# Altium schematic sheet LV_PCB.SchDoc
size A; SheetNumber: 1; SheetTotal: 1
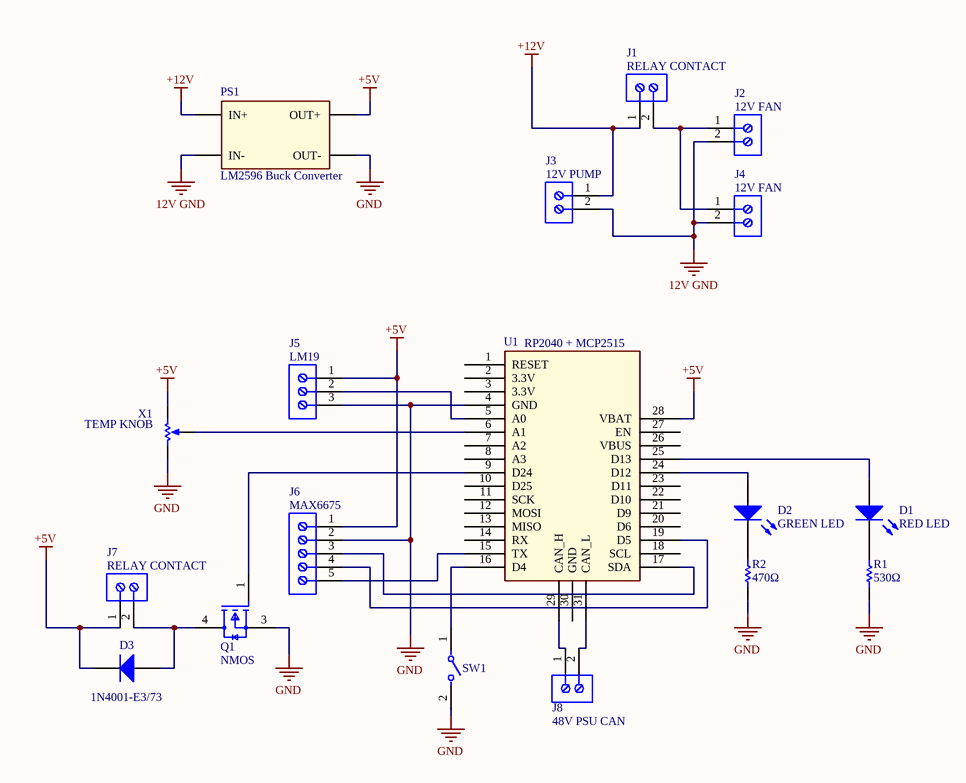
[diagram p0: LV_PCB.SchDoc]

## Parts
D1  RED LED
D2  GREEN LED
D3  1N4001-E3/73
J1  RELAY CONTACT  [2 Pin Screw Terminal 2.54mm]
J2  12V FAN  [2 Pin Screw Terminal 2.54mm]
J3  12V PUMP  [2 Pin Screw Terminal 2.54mm]
J4  12V FAN  [2 Pin Screw Terminal 2.54mm]
J5  LM19  [691254410003]
J6  MAX6675  [691243300005]
J7  RELAY CONTACT  [2 Pin Screw Terminal 2.54mm]
J8  48V PSU CAN  [691254410002]
PS1  LM2596 Buck Converter
Q1  NMOS  [FP-369AS-MFG]
R1  value 530Ω  (hidden comment: Resistor)
R2  value 470Ω  (hidden comment: Resistor)
SW1  A8L-11-12N1  [FP-A8L-11-12N1-MFG]  (value not drawn)
U1  RP2040 + MCP2515
X1  TEMP KNOB

## Nets
12V GND: J2.2 J3.2 J4.2 PS1.N(IN-)
+5V: D3.2(K) J5.1 J6.1 J7.1 PS1.?1(OUT+) U1.28(VBAT) X1.1(TOP)
+12V: J1.1 J3.1 PS1.L(IN+)
GND: J5.3 J6.2 PS1.V-(OUT-) Q1.3(S) R1.1 R2.1 SW1.2 U1.4(GND) X1.2(BOT)
NetD1_1: D1.1(A) U1.25(D13)
NetD1_2: D1.2(K) R1.2
NetD2_1: D2.1(A) U1.24(D12)
NetD2_2: D2.2(K) R2.2
NetD3_1: D3.1(A) J7.2 Q1.4(D)
NetJ1_2: J1.2 J2.1 J4.1
NetJ5_2: J5.2 U1.5(A0)
NetJ6_3: J6.3 U1.17(SDA)
NetJ6_4: J6.4 U1.19(D5)
NetJ6_5: J6.5 U1.15(TX)
NetJ8_1: J8.1 U1.29(CAN_H)
NetJ8_2: J8.2 U1.31(CAN_L)
NetQ1_1: Q1.1(G) U1.9(D24)
NetSW1_1: SW1.1 U1.16(D4)
NetU1_6: U1.6(A1) X1.3(TAP)

Not connected (* = marked no-connect by the designer): U1 1(RESET) 2(3.3V) 3(3.3V) 7(A2) 8(A3) 10(D25) 11(SCK) 12(MOSI) 13(MISO) 14(RX) 18(SCL) 20(D6) 21(D9) 22(D10) 23(D11) 26(VBUS) 27(EN) 30(GND)

## Library data of the parts
D1 D2 = LED: Light-Emitting Diode; AF: 1; BV: 0; BV_MAX: 1e99; EG: 1.11; FC: 0.5; IBV: 0.001; IS: 1e-14; MJSW: 0.33; NTUN: 30; TNOM: 27; XTI: 3; SimulationGenericComponent: True; CJO: 0; CJP: 0; CTA: 0; CTP: 0; FCS: 0.5; FV_MAX: 1e99; IKF: 0; IKR: 0; ISR: 1e-14; JSW: 0; JTUN: 0; JTUNSW: 0; KEG: 1; KF: 0; LEVEL: 1; N: 1; NBV: 1; NR: 1; NS: 1; PHP: 1; RS: 0; TCV: 0; TLEV: 0; TLEVC: 0; TM1: 0; TM2: 0; TPB: 0; TPHP: 0; TRS: 0; TRS2: 0; TT: 0; TTT1: 0; TTT2: 0; VJ: 1; XTITUN: 3
D3 = Diode: AF: 1; BV: 0; BV_MAX: 1e99; EG: 1.11; FC: 0.5; IBV: 0.001; ISR: 1e-14; MJSW: 0.33; NTUN: 30; TNOM: 27; XTI: 3; SimulationGenericComponent: True; CJO: 0; CJP: 0; CTA: 0; CTP: 0; FCS: 0.5; FV_MAX: 1e99; IKF: 0; IKR: 0; JSW: 0; JTUN: 0; JTUNSW: 0; KEG: 1; KF: 0; LEVEL: 1; N: 1; NBV: 1; NR: 1; NS: 1; PHP: 1; RS: 0; TCV: 0; TLEV: 0; TLEVC: 0; TM1: 0; TM2: 0; TPB: 0; TPHP: 0; TRS: 0; TRS2: 0; TT: 0; TTT1: 0; TTT2: 0; VJ: 1; XTITUN: 3; IS: 1e-14
J1-J4 J7 = 2 Pin Screw Terminal 2.54mm
J5 = CMP-1502-02749-3: Terminal Block, 7.62MM Pitch, Horizontal, Dual Pin, 12-30 AWG, 3 Pin
J6 = CMP-1502-02509-3: Terminal Block, 3.81MM Pitch, Vertical, Rising Cage Clamp, 30-16 AWG, 5 Pin
J8 = CMP-1502-02748-3: Terminal Block, 7.62MM Pitch, Horizontal, Dual Pin, 12-30 AWG, 2 Pin
Q1 = CMP-00278-84602781-1: FDD86581-F085 PowerTrench® MOSFET, N-Channel, 60 V, 25 A, 15 mΩ; Manufacturer Lifecycle Status: LAST SHIPMENTS; Number of Channels: 1; Continuous Drain Current (ID): 25A; Drain to Source Breakdown Voltage: 60V; Turn-On Delay Time: 7.5ns; Max Junction Temperature (Tj): 175°C; Power Dissipation: 48.4W; Drain to Source Resistance: 12.3mΩ; Turn-Off Delay Time: 14.6ns; Element Configuration: Single; Gate to Source Voltage (Vgs): 20V; Lifecycle Status: EOL; Weight: 260.37mg; NexarPartId: 84602781; Max Operating Temperature: 175°C; Min Operating Temperature: -55°C; Height: 2.517mm; Schedule B: 8541290080, 8541290080; RoHS: Compliant; Drain to Source Voltage (Vdss): 60V; Mount: Surface Mount
R1 R2 = Resistor: TC1: 0; SimulationGenericComponent: True; TC2: 0
SW1 = CMP-08830-000001-1: SWITCH ROCKER SPST 10A 125V; Max Voltage Rating (AC): 250V; Mechanical Life: 50000Cycles; Switch Function: On-Off; Electrical Life: 10000Cycles; Packaging: Bulk; Mount: Panel; Termination: PC Pins; Orientation: Straight; Max Operating Temperature: 55°C; Current Rating: 10A; RoHS Compliant: Yes; Throw Configuration: SPST; Min Operating Temperature: -20°C; Radiation Hardening: No; Voltage Rating (AC): 125V
U1 = 1528-5724-ND
X1 = Potentiometer: value: 1k; position: 0.5; SimulationGenericComponent: True